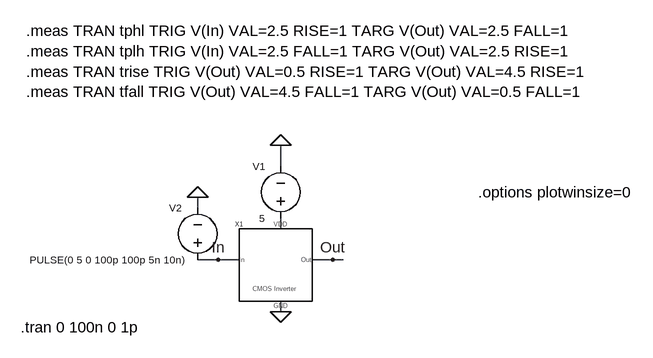
[diagram p0: schematic inverter_test.asc]
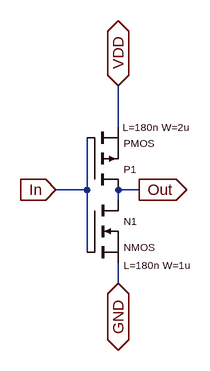
[diagram p1: sub-circuit cmos_inveter.asc]
inverter_test.asc, the LTspice schematic file:
Version 4.1
SHEET 1 880 680
WIRE 96 0 96 -32
WIRE -32 64 -32 48
WIRE 96 96 96 80
WIRE 0 144 -32 144
WIRE 32 144 0 144
WIRE 176 144 144 144
WIRE 192 144 176 144
WIRE 96 224 96 208
FLAG 96 -32 0
FLAG -32 48 0
FLAG 96 224 0
FLAG 0 144 In
FLAG 176 144 Out
SYMBOL CMOS_Inveter 80 144 R0
SYMATTR InstName X1
SYMBOL voltage 96 96 R180
WINDOW 0 24 96 Left 1
WINDOW 3 24 16 Left 1
WINDOW 123 0 0 Left 0
WINDOW 39 0 0 Left 0
SYMATTR InstName V1
SYMATTR Value 5
SYMBOL voltage -32 160 R180
WINDOW 0 24 96 Left 1
WINDOW 3 24 16 Left 1
WINDOW 123 0 0 Left 0
WINDOW 39 0 0 Left 0
SYMATTR InstName V2
SYMATTR Value PULSE(0 5 0 100p 100p 5n 10n)
TEXT -304 248 Left 2 !.tran 0 100n 0 1p
TEXT -296 -208 Left 2 !.meas TRAN tphl TRIG V(In) VAL=2.5 RISE=1 TARG V(Out) VAL=2.5 FALL=1\n.meas TRAN tplh TRIG V(In) VAL=2.5 FALL=1 TARG V(Out) VAL=2.5 RISE=1\n.meas TRAN trise TRIG V(Out) VAL=0.5 RISE=1 TARG V(Out) VAL=4.5 RISE=1\n.meas TRAN tfall TRIG V(Out) VAL=4.5 FALL=1 TARG V(Out) VAL=0.5 FALL=1
TEXT 400 40 Left 2 !.options plotwinsize=0

cmos_inveter.asc, the sub-circuit schematic file:
Version 4.1
SHEET 1 880 680
WIRE -112 -32 -112 -96
WIRE -160 64 -160 -16
WIRE -160 64 -208 64
WIRE -80 64 -112 64
WIRE -112 80 -112 64
WIRE -160 160 -160 64
WIRE -112 208 -112 176
FLAG -80 64 Out
IOPIN -80 64 Out
FLAG -208 64 In
IOPIN -208 64 In
FLAG -112 -96 VDD
IOPIN -112 -96 BiDir
FLAG -112 208 GND
IOPIN -112 208 BiDir
SYMBOL nmos -160 80 R0
WINDOW 0 56 32 Left 1
WINDOW 3 56 72 Left 1
WINDOW 123 56 100 Left 1
SYMATTR InstName N1
SYMATTR Value2 L=180n W=1u
SYMBOL pmos -160 64 M180
WINDOW 0 56 32 Left 1
WINDOW 3 56 72 Left 1
WINDOW 123 55 96 Left 1
SYMATTR InstName P1
SYMATTR Value2 L=180n W=2u

The netlist it stands for:
* inverter_test.asc
X§X1 In 0 Out N001 cmos_inveter
V1 N001 0 5
V2 In 0 PULSE(0 5 0 100p 100p 5n 10n)

* block symbol definitions
.subckt cmos_inveter In GND Out VDD
M§N1 Out In GND GND NMOS L=180n W=1u
M§P1 Out In VDD VDD PMOS L=180n W=2u
.ends cmos_inveter

.model NMOS NMOS
.model PMOS PMOS
.lib standard.mos
.tran 0 100n 0 1p
.meas TRAN tphl TRIG V(In) VAL=2.5 RISE=1 TARG V(Out) VAL=2.5 FALL=1
.meas TRAN tplh TRIG V(In) VAL=2.5 FALL=1 TARG V(Out) VAL=2.5 RISE=1
.meas TRAN trise TRIG V(Out) VAL=0.5 RISE=1 TARG V(Out) VAL=4.5 RISE=1
.meas TRAN tfall TRIG V(Out) VAL=4.5 FALL=1 TARG V(Out) VAL=0.5 FALL=1
.options plotwinsize=0
.backanno
.end

* Results of the author's LTspice run, read from the files saved beside the schematic
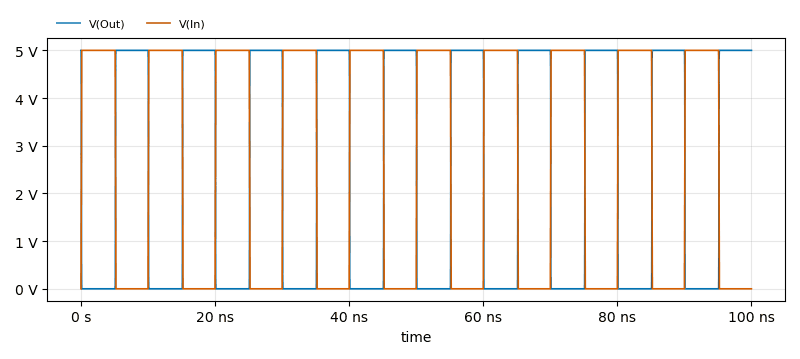
[diagram p2: Transient Analysis of inverter_test.asc, plotted from the saved traces]
* Transient Analysis, 1 run:
*   V(Out): min 0 V, max 5 V, average 2.459 V, rms 3.502 V, last 5 V
*   V(In): min 0 V, max 5 V, average 2.55 V, rms 3.559 V, last 0 V
* From the log:
*   tphl=9.05158055567e-12 FROM 4.9999998285e-11 TO 5.90515788407e-11
*   tplh=-8.96823226171e-12 FROM 5.14999999829e-09 TO 5.14103176602e-09
*   trise=2.89745508989e-11 FROM 5.12622192248e-09 TO 5.15519647338e-09
*   tfall=2.89867514882e-11 FROM 4.47979989898e-11 TO 7.3784750478e-11